# EAGLE schematic macro_keyboard_sch (EAGLE 9.2.0)
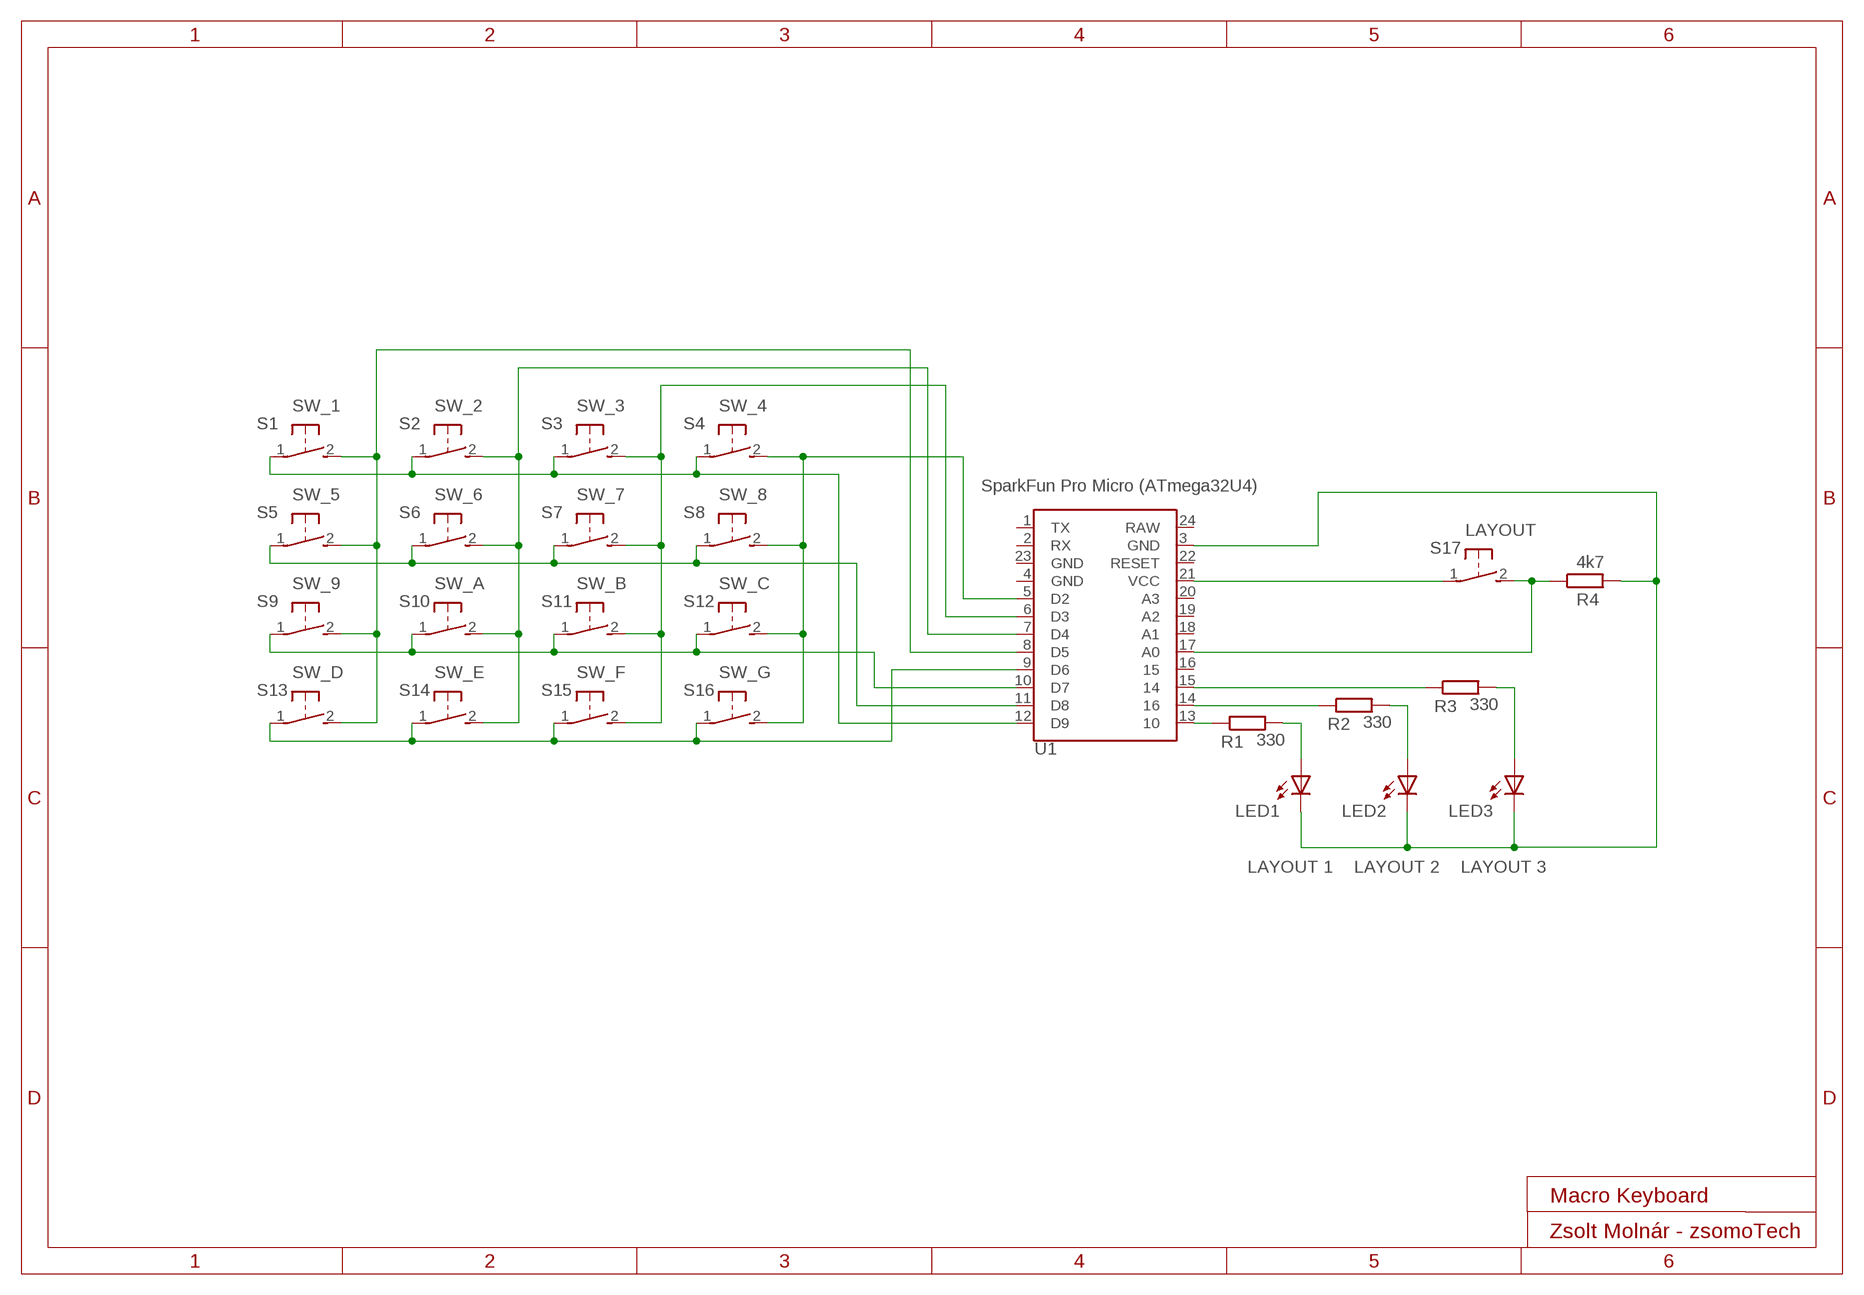
[diagram p0: schematic, sheet 1]

## Parts
LED1  LAYOUT 1  LED5MM  [LED5MM]
LED2  LAYOUT 2  LED5MM  [LED5MM]
LED3  LAYOUT 3  LED5MM  [LED5MM]
R1  330  R0207/10  [0207/10]
R2  330  R0207/10  [0207/10]
R3  330  R0207/10  [0207/10]
R4  4k7  R0207/10  [0207/10]
S1  SW_1  DTS-3  [DTS-3]
S2  SW_2  DTS-3  [DTS-3]
S3  SW_3  DTS-3  [DTS-3]
S4  SW_4  DTS-3  [DTS-3]
S5  SW_5  DTS-3  [DTS-3]
S6  SW_6  DTS-3  [DTS-3]
S7  SW_7  DTS-3  [DTS-3]
S8  SW_8  DTS-3  [DTS-3]
S9  SW_9  DTS-3  [DTS-3]
S10  SW_A  DTS-3  [DTS-3]
S11  SW_B  DTS-3  [DTS-3]
S12  SW_C  DTS-3  [DTS-3]
S13  SW_D  DTS-3  [DTS-3]
S14  SW_E  DTS-3  [DTS-3]
S15  SW_F  DTS-3  [DTS-3]
S16  SW_G  DTS-3  [DTS-3]
S17  LAYOUT  DTS-3  [DTS-3]
U1  SparkFun Pro Micro (ATmega32U4)  PRO_MICRO_C  [PRO_MICRO_C]

## Nets
N$1: S1.1 S2.1 S3.1 S4.1 U1.12(D9)
N$2: S5.1 S6.1 S7.1 S8.1 U1.11(D8)
N$3: S9.1 S10.1 S11.1 S12.1 U1.10(D7)
N$4: S13.1 S14.1 S15.1 S16.1 U1.9(D6)
N$5: S1.2 S5.2 S9.2 S13.2 U1.8(D5)
N$6: S2.2 S6.2 S10.2 S14.2 U1.7(D4)
N$7: S3.2 S7.2 S11.2 S15.2 U1.6(D3)
N$8: S4.2 S8.2 S12.2 S16.2 U1.5(D2)
N$9: R1.1 U1.13
N$10: R2.1 U1.14
N$11: R3.1 U1.15
N$12: LED1.A R1.2
N$13: LED2.A R2.2
N$14: LED3.A R3.2
N$15: S17.1 U1.21(VCC)
N$16: R4.1 S17.2 U1.17(A0)
N$17: LED1.K(C) LED2.K(C) LED3.K(C) R4.2 U1.3(GND)
Unconnected: U1.1(TX) U1.2(RX) U1.4(GND) U1.16 U1.18(A1) U1.19(A2) U1.20(A3) U1.22(RESET) U1.23(GND) U1.24(RAW)

## Notes on the sheet
- Macro Keyboard
- Zsolt Molnár - zsomoTech

## Library data of the parts
LED1-LED3 = led:LED: LED OSRAM: - CHIPLED LG R971, LG N971, LY N971, LG Q971, LY Q971, LO R971, LY R971 LH N974, LH R974 LS Q976, LO Q976, LY Q976 LO Q996 - Hyper CHIPLED LW Q18S LB Q993, LB Q99A, LB R99A - SideLED LS A670, LO A670, LY A670, LG A670, LP A670 LB A673, LV A673, LT A673, LW A673 LH A674 LY A675 LS A676, LA A676, LO A676, LY A676, LW A676 LS A679, LY A679, LG A679 - Hyper Micro SIDELED® LS Y876, LA Y876, LO Y876, LY Y876 LT Y87S - SmartLED LW L88C, LW L88S LB L89C, LB L89S, LG L890 LS L89K, LO L89K, LY L89K LS L896, LA L896, LO L896, LY L896 - TOPLED LS T670, LO T670, LY T670, LG T670, LP T670 LSG T670, LSP T670, LSY T670, LOP T670, LYG T670 LG T671, LOG T671, LSG T671 LB T673, LV T673, LT T673, LW T673 LH T674 LS T676, LA T676, LO T676, LY T676, LB T676, LH T676, LSB T676, LW T676 LB T67C, LV T67C, LT T67C, LS T67K, LO T67K, LY T67K, LW E67C LS E67B, LA E67B, LO E67B, LY E67B, LB E67C, LV E67C, LT E67C LW T67C LS T679, LY T679, LG T679 LS T770, LO T770, LY T770, LG T770, LP T770 LB T773, LV T773, LT T773, LW T773 LH T774 LS E675, LA E675, LY E675, LS T675 LS T776, LA T776, LO T776, LY T776, LB T776 LHGB T686 LT T68C, LB T68C - Hyper Mini TOPLED® LB M676 - Mini TOPLED Santana® LG M470 LS M47K, LO M47K, LY M47K Source: http://www.osram.convergy.de LUXEON: - LUMILED® LXK2-PW12-R00, LXK2-PW12-S00, LXK2-PW14-U00, LXK2-PW14-V00 LXK2-PM12-R00, LXK2-PM12-S00, LXK2-PM14-U00 LXK2-PE12-Q00, LXK2-PE12-R00, LXK2-PE12-S00, LXK2-PE14-T00, LXK2-PE14-U00 LXK2-PB12-K00, LXK2-PB12-L00, LXK2-PB12-M00, LXK2-PB14-N00, LXK2-PB14-P00, LXK2-PB14-Q00 LXK2-PR12-L00, LXK2-PR12-M00, LXK2-PR14-Q00, LXK2-PR14-R00 LXK2-PD12-Q00, LXK2-PD12-R00, LXK2-PD12-S00 LXK2-PH12-R00, LXK2-PH12-S00 LXK2-PL12-P00, LXK2-PL12-Q00, LXK2-PL12-R00 Source: www.luxeon.com KINGBRIGHT: KA-3528ASYC Source: www.kingbright.com
R1-R4 = eagle-ltspice:R: RESISTOR, European symbol; SPICEMODEL: NONE; SPICEPREFIX: R
S1-S17 = switch-tact:DTS-3
U1 = SparkFun-Boards:PRO_MICRO_C